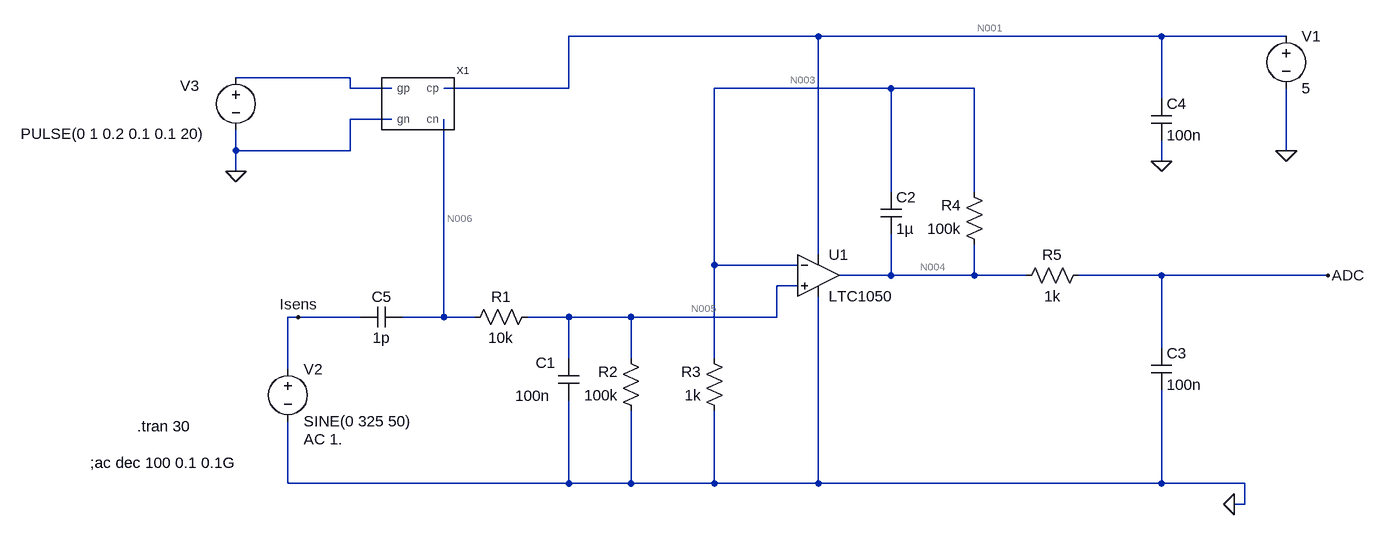
[diagram p0: schematic full_remplacement.asc]
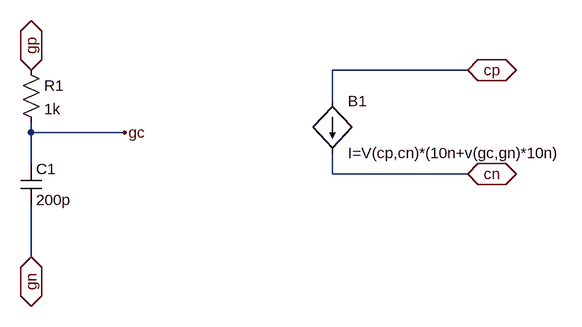
[diagram p1: sub-circuit symbcapteurgaz.asc]
full_remplacement.asc, the LTspice schematic file:
Version 4
SHEET 1 1724 680
WIRE 272 -384 -112 -384
WIRE 800 -384 272 -384
WIRE 992 -384 800 -384
WIRE -448 -320 -624 -320
WIRE -448 -304 -448 -320
WIRE -384 -304 -448 -304
WIRE -112 -304 -112 -384
WIRE -112 -304 -304 -304
WIRE 384 -304 112 -304
WIRE 512 -304 384 -304
WIRE 800 -288 800 -384
WIRE -384 -256 -448 -256
WIRE -624 -208 -624 -240
WIRE -448 -208 -448 -256
WIRE -448 -208 -624 -208
WIRE 992 -208 992 -304
WIRE 800 -192 800 -224
WIRE -624 -176 -624 -208
WIRE 384 -144 384 -304
WIRE 512 -144 512 -304
WIRE 272 -48 272 -384
WIRE 112 -32 112 -304
WIRE 240 -32 112 -32
WIRE 384 -16 384 -80
WIRE 384 -16 304 -16
WIRE 512 -16 512 -64
WIRE 512 -16 384 -16
WIRE 592 -16 512 -16
WIRE 800 -16 672 -16
WIRE 1056 -16 800 -16
WIRE 240 0 208 0
WIRE -528 48 -544 48
WIRE -432 48 -528 48
WIRE -304 48 -304 -256
WIRE -304 48 -368 48
WIRE -256 48 -304 48
WIRE -112 48 -176 48
WIRE -16 48 -112 48
WIRE 208 48 208 0
WIRE 208 48 -16 48
WIRE 800 96 800 -16
WIRE -112 112 -112 48
WIRE -16 112 -16 48
WIRE 112 112 112 -32
WIRE -544 128 -544 48
WIRE -544 304 -544 208
WIRE -112 304 -112 176
WIRE -112 304 -544 304
WIRE -16 304 -16 192
WIRE -16 304 -112 304
WIRE 112 304 112 192
WIRE 112 304 -16 304
WIRE 272 304 272 16
WIRE 272 304 112 304
WIRE 800 304 800 160
WIRE 800 304 272 304
WIRE 928 304 800 304
WIRE 928 336 928 304
WIRE 928 336 912 336
FLAG 800 -192 0
FLAG 912 336 0
FLAG 1056 -16 ADC
FLAG -528 48 Isens
FLAG 992 -208 0
FLAG -624 -176 0
SYMBOL res -160 32 R90
WINDOW 0 0 56 VBottom 2
WINDOW 3 32 56 VTop 2
SYMATTR InstName R1
SYMATTR Value 10k
SYMBOL res 0 208 R180
WINDOW 0 36 76 Left 2
WINDOW 3 36 40 Left 2
SYMATTR InstName R2
SYMATTR Value 100k
SYMBOL res 128 208 R180
WINDOW 0 36 76 Left 2
WINDOW 3 36 40 Left 2
SYMATTR InstName R3
SYMATTR Value 1k
SYMBOL res 528 -48 R180
WINDOW 0 36 76 Left 2
WINDOW 3 36 40 Left 2
SYMATTR InstName R4
SYMATTR Value 100k
SYMBOL res 576 0 R270
WINDOW 0 32 56 VTop 2
WINDOW 3 0 56 VBottom 2
SYMATTR InstName R5
SYMATTR Value 1k
SYMBOL cap -128 112 R0
WINDOW 0 -35 6 Left 2
WINDOW 3 -66 57 Left 2
SYMATTR InstName C1
SYMATTR Value 100n
SYMBOL cap 368 -144 R0
SYMATTR InstName C2
SYMATTR Value 1µ
SYMBOL cap 784 96 R0
SYMATTR InstName C3
SYMATTR Value 100n
SYMBOL cap 784 -288 R0
SYMATTR InstName C4
SYMATTR Value 100n
SYMBOL OpAmps\\LTC1050 272 -80 R0
SYMATTR InstName U1
SYMBOL voltage 992 -400 R0
WINDOW 123 0 0 Left 0
WINDOW 39 0 0 Left 0
SYMATTR InstName V1
SYMATTR Value 5
SYMBOL SymbCapteurGaz -400 -320 R0
SYMATTR InstName X1
SYMBOL voltage -544 112 R0
WINDOW 123 24 124 Left 2
WINDOW 39 0 0 Left 0
SYMATTR InstName V2
SYMATTR Value SINE(0 325 50)
SYMATTR Value2 AC 1.
SYMBOL voltage -624 -336 R0
WINDOW 0 -86 28 Left 2
WINDOW 3 -331 102 Left 2
WINDOW 123 0 0 Left 0
WINDOW 39 0 0 Left 0
SYMATTR InstName V3
SYMATTR Value PULSE(0 1 0.2 0.1 0.1 20)
SYMBOL cap -368 32 R90
WINDOW 0 0 32 VBottom 2
WINDOW 3 32 32 VTop 2
SYMATTR InstName C5
SYMATTR Value 1p
TEXT -776 216 Left 2 !.tran 30
TEXT -848 272 Left 2 !;ac dec 100 0.1 0.1G

symbcapteurgaz.asc, the sub-circuit schematic file:
Version 4
SHEET 1 880 680
WIRE 160 160 -48 160
WIRE -48 208 -48 160
WIRE -512 256 -512 240
WIRE -368 256 -512 256
WIRE -512 304 -512 256
WIRE -48 320 -48 288
WIRE 160 320 -48 320
WIRE -512 448 -512 368
FLAG -368 256 gc
FLAG -512 160 gp
IOPIN -512 160 BiDir
FLAG -512 448 gn
IOPIN -512 448 BiDir
FLAG 160 160 cp
IOPIN 160 160 BiDir
FLAG 160 320 cn
IOPIN 160 320 BiDir
SYMBOL res -528 144 R0
SYMATTR InstName R1
SYMATTR Value 1k
SYMBOL cap -528 304 R0
SYMATTR InstName C1
SYMATTR Value 200p
SYMBOL bi -48 208 R0
SYMATTR InstName B1
SYMATTR Value I=V(cp,cn)*(10n+v(gc,gn)*10n)

The netlist it stands for:
* full_remplacement.asc
R1 N005 N006 10k
R2 0 N005 100k
R3 0 N003 1k
R4 N004 N003 100k
R5 N004 ADC 1k
C1 N005 0 100n
C2 N003 N004 1µ
C3 ADC 0 100n
C4 N001 0 100n
XU1 N005 N003 N001 0 N004 LTC1050  ; pins In+ In- V+ V- OUT
V1 N001 0 5
XX1 N002 0 N001 N006 symbcapteurgaz
V2 Isens 0 SINE(0 325 50) AC 1.
V3 N002 0 PULSE(0 1 0.2 0.1 0.1 20)
C5 N006 Isens 1p

* block symbol definitions
.subckt symbcapteurgaz gp gn cp cn
R1 gp gc 1k
C1 gc gn 200p
B1 cp cn I=V(cp,cn)*(10n+v(gc,gn)*10n)
.ends symbcapteurgaz

.tran 30
;ac dec 100 0.1 0.1G
.lib LTC.lib
.backanno
.end

* Results of the author's LTspice run, read from the files saved beside the schematic
* Operating Point, zero values left out:
*   V(n005) = 4.995 mV
*   V(n006) = 5.494 mV
*   V(n003) = 4.995 mV
*   V(n004) = 504.4 mV
*   V(adc) = 504.4 mV
*   V(n001) = 5 V
*   I(R4) = 4.995 µA
*   I(R3) = -4.995 µA
*   I(R2) = -49.95 nA
*   I(R1) = -49.95 nA
*   I(V1) = -754.2 µA
*   Ix(u1:3) = 754.1 µA
*   Ix(u1:4) = -749.1 µA
*   Ix(u1:5) = -4.995 µA
*   Ix(x1:CP) = 49.95 nA
*   Ix(x1:CN) = -49.95 nA